# Altium schematic sheet vca_A.SchDoc
size 381 x 241 mm; SheetNumber: 3; SheetTotal: 12
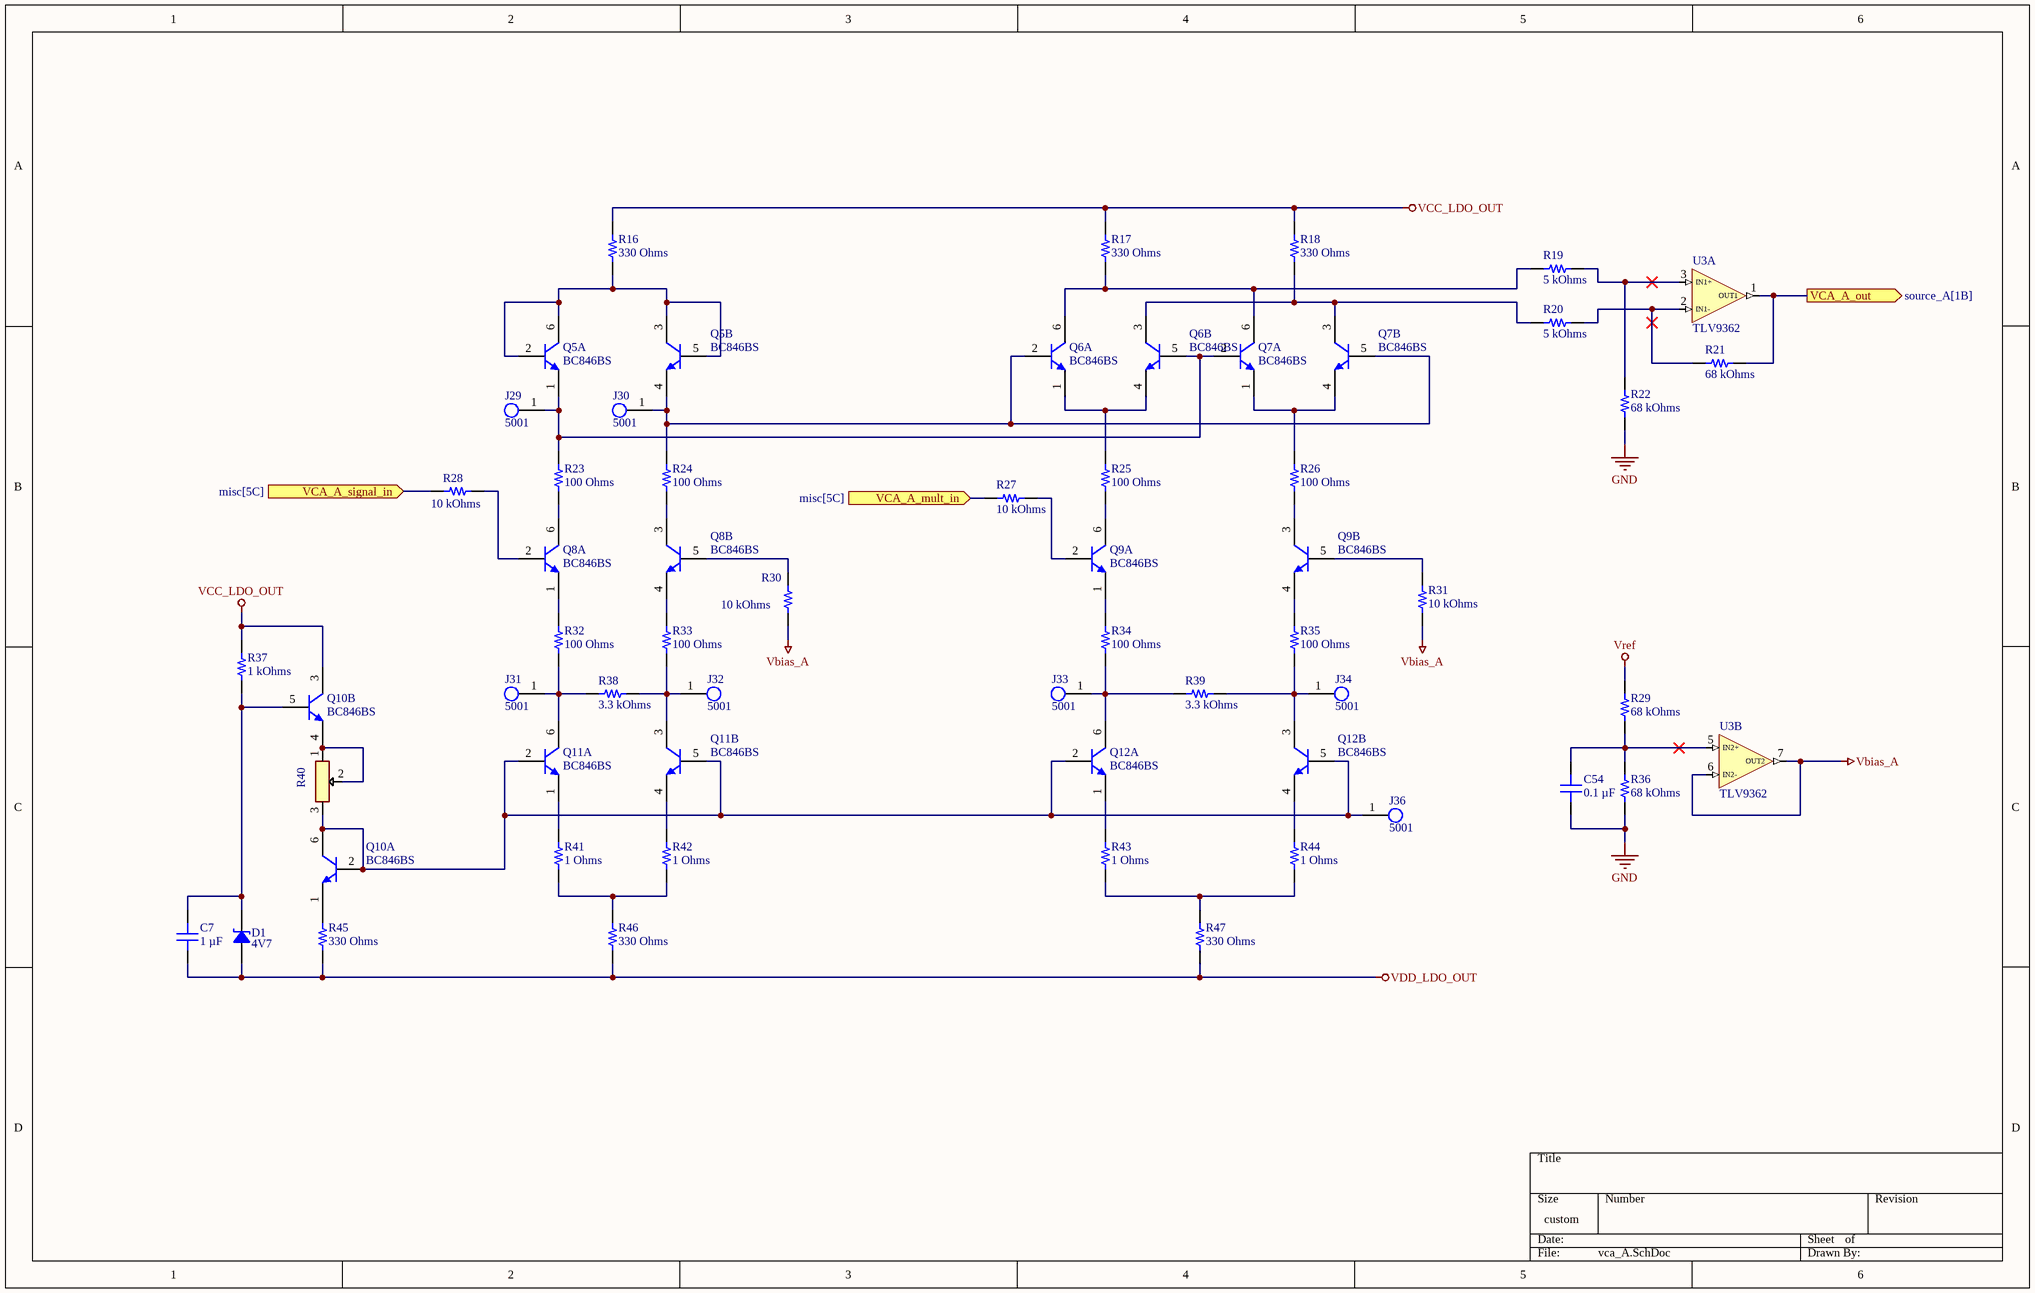
[diagram p0: vca_A.SchDoc]

## Parts
C7  1 µF  [CAP 1206_3216 - 0.8MM]
C54  0.1 µF  [CAP 1206_3216 - 0.8MM]
D1  4V7  [SOD323]
J29  5001  [FP-5001-MFG]
J30  5001  [FP-5001-MFG]
J31  5001  [FP-5001-MFG]
J32  5001  [FP-5001-MFG]
J33  5001  [FP-5001-MFG]
J34  5001  [FP-5001-MFG]
J36  5001  [FP-5001-MFG]
Q5  BC846BS  [TSOP65P210X110-6N]  (parts A,B of 2)
Q6  BC846BS  [TSOP65P210X110-6N]  (parts A,B of 2)
Q7  BC846BS  [TSOP65P210X110-6N]  (parts A,B of 2)
Q8  BC846BS  [TSOP65P210X110-6N]  (parts A,B of 2)
Q9  BC846BS  [TSOP65P210X110-6N]  (parts A,B of 2)
Q10  BC846BS  [TSOP65P210X110-6N]  (parts A,B of 2)
Q11  BC846BS  [TSOP65P210X110-6N]  (parts A,B of 2)
Q12  BC846BS  [TSOP65P210X110-6N]  (parts A,B of 2)
R16  330 Ohms  [YAGEO RES 1206_3216]
R17  330 Ohms  [YAGEO RES 1206_3216]
R18  330 Ohms  [YAGEO RES 1206_3216]
R19  5 kOhms  [YAGEO RES 1206_3216]
R20  5 kOhms  [YAGEO RES 1206_3216]
R21  68 kOhms  [YAGEO RES 1206_3216]
R22  68 kOhms  [YAGEO RES 1206_3216]
R23  100 Ohms  [YAGEO RES 1206_3216]
R24  100 Ohms  [YAGEO RES 1206_3216]
R25  100 Ohms  [YAGEO RES 1206_3216]
R26  100 Ohms  [YAGEO RES 1206_3216]
R27  10 kOhms  [YAGEO RES 1206_3216]
R28  10 kOhms  [YAGEO RES 1206_3216]
R29  68 kOhms  [YAGEO RES 1206_3216]
R30  10 kOhms  [YAGEO RES 1206_3216]
R31  10 kOhms  [YAGEO RES 1206_3216]
R32  100 Ohms  [YAGEO RES 1206_3216]
R33  100 Ohms  [YAGEO RES 1206_3216]
R34  100 Ohms  [YAGEO RES 1206_3216]
R35  100 Ohms  [YAGEO RES 1206_3216]
R36  68 kOhms  [YAGEO RES 1206_3216]
R37  1 kOhms  [YAGEO RES 1206_3216]
R38  3.3 kOhms  [YAGEO RES 1206_3216]
R39  3.3 kOhms  [YAGEO RES 1206_3216]
R40  TC33X-2-502G  [TC33X2503E]  (value not drawn)
R41  1 Ohms  [YAGEO RES 1206_3216]
R42  1 Ohms  [YAGEO RES 1206_3216]
R43  1 Ohms  [YAGEO RES 1206_3216]
R44  1 Ohms  [YAGEO RES 1206_3216]
R45  330 Ohms  [YAGEO RES 1206_3216]
R46  330 Ohms  [YAGEO RES 1206_3216]
R47  330 Ohms  [YAGEO RES 1206_3216]
U3  TLV9362  [SOIC8-127P600X175-8N]  (parts A,B of 3)

## Ports
VCA_A_mult_in (in, see misc[5C]), VCA_A_out (out, see source_A[1B]), VCA_A_signal_in (in, see misc[5C])

## Nets
GND: C54.1 R22.2 R36.1
Vbias_A: R30.1 R31.1 U3.6(IN2-) U3.7(OUT2)
VCC_LDO_OUT: Q10.3(C2) R16.2 R17.2 R18.2 R37.2
VDD_LDO_OUT: C7.1 D1.1 R45.1 R46.1 R47.1
Vref: R29.2
VCA_A_mult_in: R27.1 ; port VCA_A_mult_in
VCA_A_out: R21.1 U3.1(OUT1) ; port VCA_A_out
VCA_A_signal_in: R28.1 ; port VCA_A_signal_in
NetC7_2: C7.2 D1.2 Q10.5(B2) R37.1
NetC54_2: C54.2 R29.1 R36.2 U3.5(IN2+)
NetJ29_1: J29.1 Q5.1(E1) Q6.5(B2) Q7.2(B1) R23.2
NetJ30_1: J30.1 Q5.4(E2) Q6.2(B1) Q7.5(B2) R24.2
NetJ31_1: J31.1 Q11.6(C1) R32.1 R38.2
NetJ32_1: J32.1 Q11.3(C2) R33.1 R38.1
NetJ33_1: J33.1 Q12.6(C1) R34.1 R39.2
NetJ34_1: J34.1 Q12.3(C2) R35.1 R39.1
NetJ36_1: J36.1 Q10.2(B1) Q10.6(C1) Q11.2(B1) Q11.5(B2) Q12.2(B1) Q12.5(B2) R40.3(CW)
NetQ5_2: Q5.2(B1) Q5.3(C2) Q5.5(B2) Q5.6(C1) R16.1
NetQ6_1: Q6.1(E1) Q6.4(E2) R25.2
NetQ6_3: Q6.3(C2) Q7.3(C2) R18.1 R20.2
NetQ6_6: Q6.6(C1) Q7.6(C1) R17.1 R19.2
NetQ7_1: Q7.1(E1) Q7.4(E2) R26.2
NetQ8_1: Q8.1(E1) R32.2
NetQ8_2: Q8.2(B1) R28.2
NetQ8_3: Q8.3(C2) R24.1
NetQ8_4: Q8.4(E2) R33.2
NetQ8_5: Q8.5(B2) R30.2
NetQ8_6: Q8.6(C1) R23.1
NetQ9_1: Q9.1(E1) R34.2
NetQ9_2: Q9.2(B1) R27.2
NetQ9_3: Q9.3(C2) R26.1
NetQ9_4: Q9.4(E2) R35.2
NetQ9_5: Q9.5(B2) R31.2
NetQ9_6: Q9.6(C1) R25.1
NetQ10_1: Q10.1(E1) R45.2
NetQ10_4: Q10.4(E2) R40.1(CCW) R40.2(W)
NetQ11_1: Q11.1(E1) R41.2
NetQ11_4: Q11.4(E2) R42.2
NetQ12_1: Q12.1(E1) R43.2
NetQ12_4: Q12.4(E2) R44.2
NetR19_1: R19.1 R22.1 U3.3(IN1+)
NetR20_1: R20.1 R21.2 U3.2(IN1-)
NetR41_1: R41.1 R42.1 R46.2
NetR43_1: R43.1 R44.1 R47.2

## Library data of the parts
C7 = 885012208093: CAP CER 1UF 50V X7R 1206; manufacturer: Würth Elektronik; Tolerance: ±10%; Part Number: 885012208093; Capacitance: 1 µF; Applications: General Purpose; componentlink1description: Datasheet; componentlink1url: https://katalog.we-online.de/pbs/datasheet/885012208093.pdf; componentlink2description: DigiKey Link; componentlink2url: https://www.digikey.com/en/products/detail/würth-elektronik/885012208093/5453432; Device Package: 1206 (3216 Metric); lastupdated: 6/4/2024 19:10:33; Lifecycle Status: Active; Minimum Order: 1; Mounting Type: Surface Mount, MLCC; Operating Temperature: -55°C ~ 125°C; Package / Case: 1206 (3216 Metric); packaging: TapeAndReel; partid: 39665; Part Status: Active; price: 0.10; series: WCAP-CSGP; Size / Dimension: 0.126" L x 0.063" W (3.20mm x 1.60mm); Supplier 1: DigiKey; Supplier Part Number 1: 732-7577-1-ND; Temperature Coefficient: X7R; Thickness (Max): 0.075" (1.90mm); value: 1 µF; Voltage - Rated: 50V
C54 = 885012208087: CAP CER 0.1UF 50V X7R 1206; manufacturer: Würth Elektronik; Tolerance: ±10%; Part Number: 885012208087; Capacitance: 0.1 µF; Applications: General Purpose; componentlink1description: Datasheet; componentlink1url: https://katalog.we-online.de/pbs/datasheet/885012208087.pdf; componentlink2description: DigiKey Link; componentlink2url: https://www.digikey.com/en/products/detail/würth-elektronik/885012208087/5453982; Device Package: 1206 (3216 Metric); lastupdated: 6/4/2024 19:10:27; Lifecycle Status: Active; Minimum Order: 1; Mounting Type: Surface Mount, MLCC; Operating Temperature: -55°C ~ 125°C; Package / Case: 1206 (3216 Metric); packaging: TapeAndReel; partid: 20879; Part Status: Active; price: 0.06; series: WCAP-CSGP; Size / Dimension: 0.126" L x 0.063" W (3.20mm x 1.60mm); Supplier 1: DigiKey; Supplier Part Number 1: 732-8127-1-ND; Temperature Coefficient: X7R; Thickness (Max): 0.035" (0.90mm); value: 0.1 µF; Voltage - Rated: 50V
D1 = BZX38450-C4V7X
J29-J34 J36 = CMP-2000-05181-2: PC TEST POINT MINIATURE BLACK; Body Material: Bronze; Plating: Silver; Inside Diameter: 1.27mm; Hole Diameter: 1.6mm; Number of Ports: 1; Outside Diameter: 2.54mm; Insulation: Insulated; Insulation Material: Nylon; Mount: Through Hole; RoHS Compliant: Yes; Series: THM; Height: 0.3inch; Termination: Through Hole; Material: Nylon; Packaging: Bulk; Contact Material: Bronze; REACH SVHC: No SVHC; Contact Plating: Silver; Orientation: Straight; Lead Free: Lead Free; Package Quantity: 100; Length: 7.62mm; Flammability Rating: UL94 V-0; Number of Contacts: 1; Diameter: 2.54mm; Housing Color: Black; Color: Black
Q5-Q12 = BC846BS: 65 V, 100 mA matched NPN/NPN general-purpose transistor; ComponentLink1Description: Datasheet; ComponentLink1URL: https://assets.nexperia.com/documents/data-sheet/BC846BS.pdf
R16-R18 R45-R47 = RT1206FRD07330RL: RES SMD 330 OHM 1% 1/4W 1206; Manufacturer: Yageo; Power (Watts): 0.25W, 1/4W; Temperature Coefficient: ±25ppm/°C; Part Number: RT1206FRD07330RL; ComponentLink1Description: Datasheet; ComponentLink1URL: https://www.yageo.com/upload/media/product/productsearch/datasheet/rchip/PYu-RT_1-to-0.01_RoHS_L_15.pdf; ComponentLink2Description: DigiKey Link; ComponentLink2URL: https://www.digikey.com/en/products/detail/yageo/RT1206FRD07330RL/5938576; Composition: Thin Film; Device Package: 1206 (3216 Metric); Height - Seated (Max): 0.026" (0.65mm); LastUpdated: 7/25/2024 09:21:16; Lifecycle Status: Active; Minimum Order: 1; Number of Terminations: 2; Operating Temperature: -55°C ~ 155°C; Package / Case: 1206 (3216 Metric); Packaging: TapeAndReel; PartId: 79140; Price: 0.01; Resistance: 330 Ohms; Series: RT; Size / Dimension: 0.122" L x 0.063" W (3.10mm x 1.60mm); Supplier 1: DigiKey; Supplier Part Number 1: 13-RT1206FRD07330RLCT-ND; Supplier Device Package: 1206; Tolerance: ±1%; Value: 330 Ohms
R19 R20 = RT1206FRE075KL: RES 5K OHM 1% 1/4W 1206; Manufacturer: Yageo; Power (Watts): 0.25W, 1/4W; Temperature Coefficient: ±50ppm/°C; Part Number: RT1206FRE075KL; ComponentLink1Description: Datasheet; ComponentLink1URL: https://www.yageo.com/upload/media/product/app/datasheet/rchip/pyu-rt_1-to-0.01_rohs_l.pdf; ComponentLink2Description: DigiKey Link; ComponentLink2URL: https://www.digikey.com/en/products/detail/yageo/RT1206FRE075KL/7708705; Composition: Thin Film; Device Package: 1206 (3216 Metric); Height - Seated (Max): 0.026" (0.65mm); LastUpdated: 7/25/2024 09:21:03; Lifecycle Status: Active; Minimum Order: 1; Number of Terminations: 2; Operating Temperature: -55°C ~ 155°C; Package / Case: 1206 (3216 Metric); Packaging: TapeAndReel; PartId: 88354; Price: 0.01; Resistance: 5 kOhms; Series: RT; Size / Dimension: 0.122" L x 0.063" W (3.10mm x 1.60mm); Supplier 1: DigiKey; Supplier Part Number 1: 13-RT1206FRE075KLCT-ND; Supplier Device Package: 1206; Tolerance: ±1%; Value: 5 kOhms
R21 R22 R29 R36 = RT1206FRE0768KL: RES SMD 68K OHM 1% 1/4W 1206; Manufacturer: Yageo; Power (Watts): 0.25W, 1/4W; Temperature Coefficient: ±50ppm/°C; Part Number: RT1206FRE0768KL; ComponentLink1Description: Datasheet; ComponentLink1URL: https://www.yageo.com/upload/media/product/productsearch/datasheet/rchip/PYu-RT_1-to-0.01_RoHS_L_12.pdf; ComponentLink2Description: DigiKey Link; ComponentLink2URL: https://www.digikey.com/en/products/detail/yageo/RT1206FRE0768KL/1083332; Composition: Thin Film; Device Package: 1206 (3216 Metric); Height - Seated (Max): 0.026" (0.65mm); LastUpdated: 7/25/2024 09:21:23; Lifecycle Status: Active; Minimum Order: 1; Number of Terminations: 2; Operating Temperature: -55°C ~ 155°C; Package / Case: 1206 (3216 Metric); Packaging: TapeAndReel; PartId: 58462; Part Status: Active; Price: 0.01; Resistance: 68 kOhms; Series: RT; Size / Dimension: 0.122" L x 0.063" W (3.10mm x 1.60mm); Supplier 1: DigiKey; Supplier Part Number 1: 13-RT1206FRE0768KLCT-ND; Supplier Device Package: 1206; Tolerance: ±1%; Value: 68 kOhms
R23-R26 R32-R35 = RT1206FRD07100RL: RES SMD 100 OHM 1% 1/4W 1206; Manufacturer: Yageo; Power (Watts): 0.25W, 1/4W; Temperature Coefficient: ±25ppm/°C; Part Number: RT1206FRD07100RL; ComponentLink1Description: Datasheet; ComponentLink1URL: https://www.yageo.com/upload/media/product/productsearch/datasheet/rchip/PYu-RT_1-to-0.01_RoHS_L_12.pdf; ComponentLink2Description: DigiKey Link; ComponentLink2URL: https://www.digikey.com/en/products/detail/yageo/RT1206FRD07100RL/5938292; Composition: Thin Film; Device Package: 1206 (3216 Metric); Height - Seated (Max): 0.026" (0.65mm); LastUpdated: 7/25/2024 09:21:23; Lifecycle Status: Active; Minimum Order: 1; Number of Terminations: 2; Operating Temperature: -55°C ~ 155°C; Package / Case: 1206 (3216 Metric); Packaging: TapeAndReel; PartId: 58461; Part Status: Active; Price: 0.01; Resistance: 100 Ohms; Series: RT; Size / Dimension: 0.122" L x 0.063" W (3.10mm x 1.60mm); Supplier 1: DigiKey; Supplier Part Number 1: 13-RT1206FRD07100RLCT-ND; Supplier Device Package: 1206; Tolerance: ±1%; Value: 100 Ohms
R27 R28 R30 R31 = RT1206FRE0710KL: RES SMD 10K OHM 1% 1/4W 1206; Manufacturer: Yageo; Power (Watts): 0.25W, 1/4W; Temperature Coefficient: ±50ppm/°C; Part Number: RT1206FRE0710KL; ComponentLink1Description: Datasheet; ComponentLink1URL: https://www.yageo.com/upload/media/product/productsearch/datasheet/rchip/PYu-RT_1-to-0.01_RoHS_L_11.pdf; ComponentLink2Description: DigiKey Link; ComponentLink2URL: https://www.digikey.com/en/products/detail/yageo/RT1206FRE0710KL/1082868; Composition: Thin Film; Device Package: 1206 (3216 Metric); Height - Seated (Max): 0.026" (0.65mm); LastUpdated: 7/25/2024 09:21:28; Lifecycle Status: Active; Minimum Order: 1; Number of Terminations: 2; Operating Temperature: -55°C ~ 155°C; Package / Case: 1206 (3216 Metric); Packaging: TapeAndReel; PartId: 38903; Part Status: Active; Price: 0.01; Resistance: 10 kOhms; Series: RT; Size / Dimension: 0.122" L x 0.063" W (3.10mm x 1.60mm); Supplier 1: DigiKey; Supplier Part Number 1: YAG1242CT-ND; Supplier Device Package: 1206; Tolerance: ±1%; Value: 10 kOhms
R37 = RT1206FRE071KL: RES SMD 1K OHM 1% 1/4W 1206; Manufacturer: Yageo; Power (Watts): 0.25W, 1/4W; Temperature Coefficient: ±50ppm/°C; Part Number: RT1206FRE071KL; ComponentLink1Description: Datasheet; ComponentLink1URL: https://www.yageo.com/upload/media/product/productsearch/datasheet/rchip/PYu-RT_1-to-0.01_RoHS_L_11.pdf; ComponentLink2Description: DigiKey Link; ComponentLink2URL: https://www.digikey.com/en/products/detail/yageo/RT1206FRE071KL/1083016; Composition: Thin Film; Device Package: 1206 (3216 Metric); Height - Seated (Max): 0.026" (0.65mm); LastUpdated: 7/25/2024 09:21:27; Lifecycle Status: Active; Minimum Order: 1; Number of Terminations: 2; Operating Temperature: -55°C ~ 155°C; Package / Case: 1206 (3216 Metric); Packaging: TapeAndReel; PartId: 40465; Part Status: Active; Price: 0.01; Resistance: 1 kOhms; Series: RT; Size / Dimension: 0.122" L x 0.063" W (3.10mm x 1.60mm); Supplier 1: DigiKey; Supplier Part Number 1: YAG3366CT-ND; Supplier Device Package: 1206; Tolerance: ±1%; Value: 1 kOhms
R38 R39 = RT1206FRE073K3L: RES SMD 3.3K OHM 1% 1/4W 1206; Manufacturer: Yageo; Power (Watts): 0.25W, 1/4W; Temperature Coefficient: ±50ppm/°C; Part Number: RT1206FRE073K3L; ComponentLink1Description: Datasheet; ComponentLink1URL: https://www.yageo.com/upload/media/product/productsearch/datasheet/rchip/PYu-RT_1-to-0.01_RoHS_L_12.pdf; ComponentLink2Description: DigiKey Link; ComponentLink2URL: https://www.digikey.com/en/products/detail/yageo/RT1206FRE073K3L/1083187; Composition: Thin Film; Device Package: 1206 (3216 Metric); Height - Seated (Max): 0.026" (0.65mm); LastUpdated: 7/25/2024 09:21:22; Lifecycle Status: Active; Minimum Order: 1; Number of Terminations: 2; Operating Temperature: -55°C ~ 155°C; Package / Case: 1206 (3216 Metric); Packaging: TapeAndReel; PartId: 58380; Price: 0.01; Resistance: 3.3 kOhms; Series: RT; Size / Dimension: 0.122" L x 0.063" W (3.10mm x 1.60mm); Supplier 1: DigiKey; Supplier Part Number 1: 13-RT1206FRE073K3LCT-ND; Supplier Device Package: 1206; Tolerance: ±1%; Value: 3.3 kOhms; Part Status: Active
R40 = TC33X-2-502G: Resistor; Manufacturer_Name: Bourns; Datasheet Link: https://componentsearchengine.com/Datasheets/1/TC33X-2-502G.pdf; Height: 1.2mm; Manufacturer_Part_Number: TC33X-2-502G; Mouser Part Number: 652-TC33X-2-502G; Mouser Price/Stock: https://www.mouser.co.uk/ProductDetail/Bourns/TC33X-2-502G?qs=UmpSLsh52mVfPYqLYJpjzQ%3D%3D; Arrow Part Number: TC33X-2-502G; Arrow Price/Stock: https://www.arrow.com/en/products/tc33x-2-502g/bourns?region=nac
R41-R44 = RT1206BRD071RL: RES 1 OHM 0.1% 1/4W 1206; Manufacturer: Yageo; Power (Watts): 0.25W, 1/4W; Temperature Coefficient: ±25ppm/°C; Part Number: RT1206BRD071RL; ComponentLink1Description: Datasheet; ComponentLink1URL: https://www.yageo.com/upload/media/product/productsearch/datasheet/rchip/PYu-RT_1-to-0.01_RoHS_L_15.pdf; ComponentLink2Description: DigiKey Link; ComponentLink2URL: https://www.digikey.com/en/products/detail/yageo/RT1206BRD071RL/17018181; Composition: Thin Film; Device Package: 1206 (3216 Metric); Features: Moisture Resistant; Height - Seated (Max): 0.026" (0.65mm); LastUpdated: 7/25/2024 09:21:16; Lifecycle Status: Active; Minimum Order: 1; Number of Terminations: 2; Operating Temperature: -55°C ~ 155°C; Package / Case: 1206 (3216 Metric); Packaging: TapeAndReel; PartId: 79150; Price: 0.14; Resistance: 1 Ohms; Series: RT; Size / Dimension: 0.122" L x 0.063" W (3.10mm x 1.60mm); Supplier 1: DigiKey; Supplier Part Number 1: 13-RT1206BRD071RLCT-ND; Supplier Device Package: 1206; Tolerance: ±0.1%; Value: 1 Ohms
U3 = TLV9362: TLV936x 10-MHz, 40-V, RRO, Operational Amplifie; ComponentLink1Description: Datasheet; ComponentLink1URL: https://www.ti.com/lit/ds/symlink/tlv9362.pdf